# Altium project GP-MAX-MQ.PrjPcb
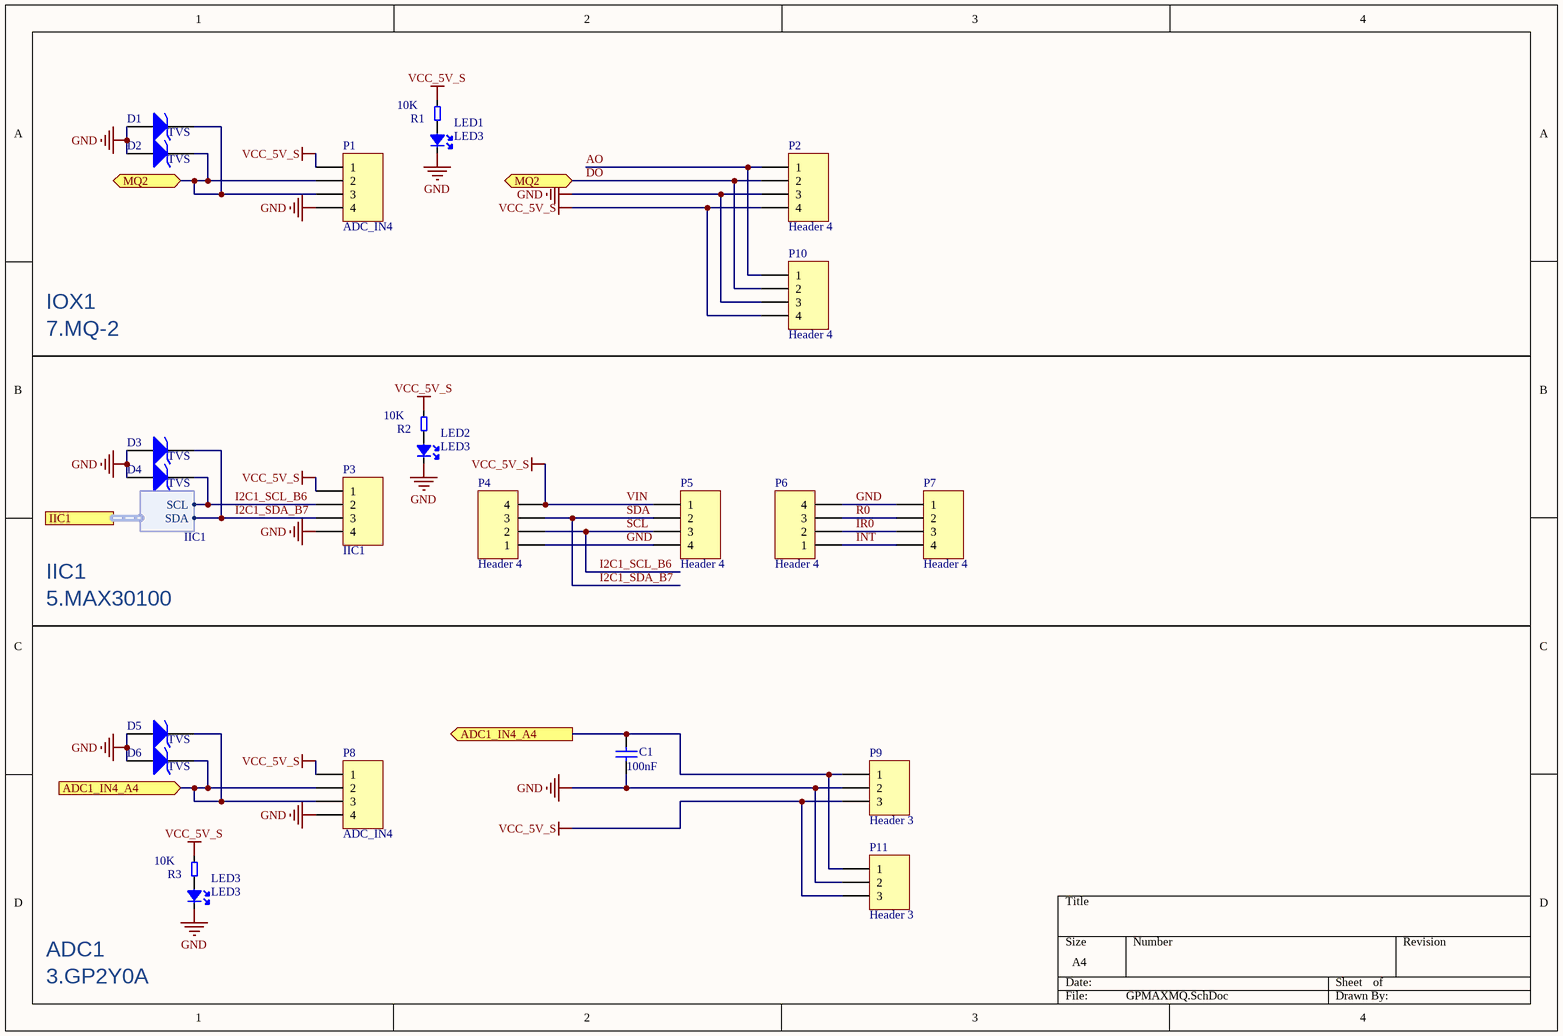
[diagram p0: GPMAXMQ.SchDoc]
1 sheet, 24 parts. Net scope: flat (ports and power ports of the same name join across sheets).
Board file: SensorGroupB.PcbDoc

## Sheet GPMAXMQ.SchDoc
size A4; DocumentNumber: 1; SheetNumber: 1; SheetTotal: 1

### Parts
C1  value 100nF  [C 0603_L]  (hidden comment: CAP)
D1  TVS  [SOD-523]
D2  TVS  [SOD-523]
D3  TVS  [SOD-523]
D4  TVS  [SOD-523]
D5  TVS  [SOD-523]
D6  TVS  [SOD-523]
LED1  LED3  [0603-led]
LED2  LED3  [0603-led]
LED3  LED3  [0603-led]
P1  ADC_IN4  [KF2EDGK-2.54-WI-4P]
P2  Header 4  [HDR2.54-LI-4P]
P3  IIC1  [KF2EDGK-2.54-WI-4P]
P4  Header 4  [HDR2.54-LI-4P]
P5  Header 4  [HDR2.54-LI-4P]
P6  Header 4  [HDR2.54-LI-4P]
P7  Header 4  [HDR2.54-LI-4P]
P8  ADC_IN4  [KF2EDGK-2.54-WI-4P]
P9  Header 3  [HDR2.54-LI-3P]
P10  Header 4  [HDR2.54-LI-4P]
P11  Header 3  [HDR2.54-LI-3P]
R1  10K  [0603]
R2  10K  [0603]
R3  10K  [0603]

### Ports
ADC1_IN4_A4 (in), ADC1_IN4_A4 (out), IIC1 (harness IIC1), MQ2 (bidir)

### Harnesses
IIC1: SCL, SDA

### Nets
GND: C1.1 D1.1(A) D2.1(A) D3.1(A) D4.1(A) D5.1(A) D6.1(A) LED1.2(K) LED2.2(K) LED3.2(K) P1.4 P2.3 P3.4 P4.1 P5.4 P6.4 P7.1 P8.4 P9.2 P10.3 P11.2
VIN: P1.1 P2.4 P3.1 P4.4 P5.1 P8.1 P9.3 P10.4 P11.3 R1.2 R2.2 R3.2  [also labelled VCC_5V_S]
AO: P2.1 P10.1
DO: D1.2(K) D2.2(K) P1.2 P1.3 P2.2 P10.2 ; port MQ2
I2C1_SCL_B6: D4.2(K) P3.2 P4.2 P5.3 ; port IIC1.SCL  [also labelled SCL]
I2C1_SDA_B7: D3.2(K) P3.3 P4.3 P5.2 ; port IIC1.SDA  [also labelled SDA]
INT: P6.1 P7.4
IR0: P6.2 P7.3
R0: P6.3 P7.2
NetC1_2: C1.2 D5.2(K) D6.2(K) P8.2 P8.3 P9.1 P11.1 ; port ADC1_IN4_A4
NetLED1_1: LED1.1(A) R1.1
NetLED2_1: LED2.1(A) R2.1
NetLED3_1: LED3.1(A) R3.1

### Notes on the sheet
- IOX1
- 7.MQ-2
- IIC1
- 5.MAX30100
- 3.GP2Y0A
- ADC1

### Library data of the parts
D1-D6 = D: High Conductance Fast Diode; Published: 8-Jun-2000; LatestRevisionDate: 17-Jul-2002; LatestRevisionNote: Re-released for DXP Platform.; DatasheetVersion: 1997; PackageReference: DO-35; Publisher: Altium Limited; PackageDescription: Diode, Axial; Body 3.8 x 1.9 mm (LxDia. max), Lead Dia. 0.53 mm (max); Code_JEDEC: DO-204-AH; ComponentLink1Description: Manufacturer Link; ComponentLink1URL: http://www.fairchildsemi.com/; ComponentLink2Description: Datasheet; ComponentLink2URL: http://www.fairchildsemi.com/ds/1N%2F1N4148.pdf
LED1-LED3 = CP_DIOLED: DIODE LED
P1-P8 P10 = Header 4: Header, 4-Pin; LatestRevisionDate: 17-Jul-2002; LatestRevisionNote: Re-released for DXP Platform.; Publisher: Altium Limited
P9 P11 = Header 3: Header, 3-Pin; LatestRevisionDate: 17-Jul-2002; LatestRevisionNote: Re-released for DXP Platform.; Publisher: Altium Limited
R1-R3 = RES2